# Altium project USB_TO_IO_DEVICE_V102.PrjPCB
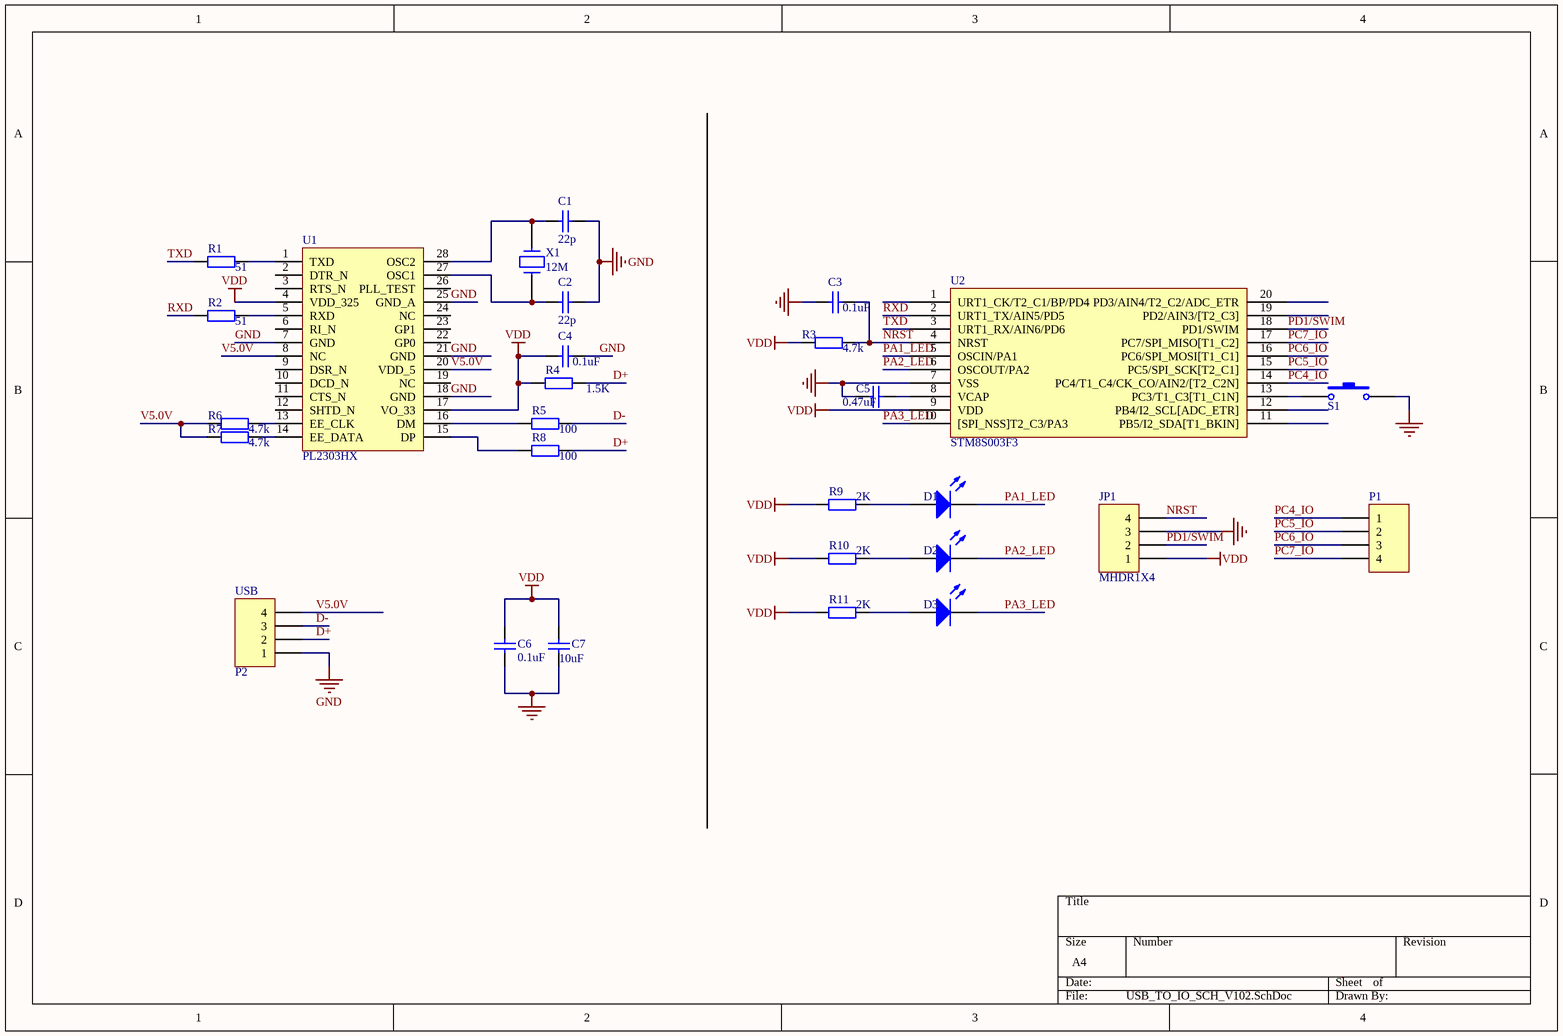
[diagram p0: USB_TO_IO_SCH_V102.SchDoc]
1 sheet, 28 parts. Net scope: global (net labels, ports and power ports of the same name join across sheets).
Board file: USB_TO_IO_PCB_V102.PcbDoc

## Sheet USB_TO_IO_SCH_V102.SchDoc
size A4

### Parts
C1  value 22p  [CS0603]  (hidden comment: Cap_0603)
C2  value 22p  [CS0603]  (hidden comment: Cap_0603)
C3  value 0.1uF  [CS0603]  (hidden comment: Cap_0603)
C4  value 0.1uF  [CS0603]  (hidden comment: Cap_0603)
C5  value 0.47uF  [CS0603]  (hidden comment: Cap_0603)
C6  value 0.1uF  [CS0603]  (hidden comment: Cap_0603)
C7  value 10uF  [CAP_8050]  (hidden comment: Cap_0603)
D1  LED  [LED_0603]  (value not drawn)
D2  LED  [LED_0603]  (value not drawn)
D3  LED  [LED_0603]  (value not drawn)
JP1  MHDR1X4  [MHDR1X4]
P1  Header 4  [HDR1X4]  (value not drawn)
P2  USB  [USB_M]
R1  value 51  [S0603]  (hidden comment: Reg_0603)
R2  value 51  [S0603]  (hidden comment: Reg_0603)
R3  value 4.7k  [S0603]  (hidden comment: Reg_0603)
R4  value 1.5K  [S0603]  (hidden comment: Reg_0603)
R5  value 100  [S0603]  (hidden comment: Reg_0603)
R6  value 4.7k  [S0603]  (hidden comment: Reg_0603)
R7  value 4.7k  [S0603]  (hidden comment: Reg_0603)
R8  value 100  [S0603]  (hidden comment: Reg_0603)
R9  value 2K  [S0603]  (hidden comment: Reg_0603)
R10  value 2K  [S0603]  (hidden comment: Reg_0603)
R11  value 2K  [S0603]  (hidden comment: Reg_0603)
S1  SW  [SWITCH-2]  (value not drawn)
U1  PL2303HX  [SSOP28]
U2  STM8S003F3  [STM8S003F3]
X1  value 12M  [XATL]  (hidden comment: CRYSTAL)

### Nets
GND: C1.2 C2.2 C3.1 C4.2 C5.1 C6.1 C7.1 JP1.3 P2.1 S1.2 U1.7(GND) U1.18(GND) U1.21(GND) U1.25(GND_A) U2.7(VSS)
VDD: C4.1 C6.2 C7.2 JP1.1 R3.1 R4.1 R9.1 R10.1 R11.1 U1.4(VDD_325) U1.17(VO_33) U2.9(VDD)
D+: P2.2 R4.2 R8.2
D-: P2.3 R5.2
NRST: C3.2 JP1.4 R3.2 U2.4(NRST)
PA1_LED: D1.2(K) U2.5(OSCIN/PA1)
PA2_LED: D2.2(K) U2.6(OSCOUT/PA2)
PA3_LED: D3.2(K) U2.10([SPI_NSS]T2_C3/PA3)
PC4_IO: P1.1 U2.14(PC4/T1_C4/CK_CO/AIN2/[T2_C2N])
PC5_IO: P1.2 U2.15(PC5/SPI_SCK[T2_C1])
PC6_IO: P1.3 U2.16(PC6/SPI_MOSI[T1_C1])
PC7_IO: P1.4 U2.17(PC7/SPI_MISO[T1_C2])
PD1/SWIM: JP1.2 U2.18(PD1/SWIM)
RXD: R2.1 U2.2(URT1_TX/AIN5/PD5)
TXD: R1.1 U2.3(URT1_RX/AIN6/PD6)
V5.0V: P2.4 R6.1 R7.1 U1.8(NC) U1.20(VDD_5)
NetC1_1: C1.1 U1.28(OSC2) X1.2
NetC2_1: C2.1 U1.27(OSC1) X1.1
NetC5_2: C5.2 U2.8(VCAP)
NetD1_1: D1.1(A) R9.2
NetD2_1: D2.1(A) R10.2
NetD3_1: D3.1(A) R11.2
NetR1_2: R1.2 U1.1(TXD)
NetR2_2: R2.2 U1.5(RXD)
NetR5_1: R5.1 U1.16(DM)
NetR6_2: R6.2 U1.13(EE_CLK)
NetR7_2: R7.2 U1.14(EE_DATA)
NetR8_1: R8.1 U1.15(DP)
NetS1_1: S1.1 U2.13(PC3/T1_C3[T1_C1N])

Not connected (* = marked no-connect by the designer): U1 2(DTR_N) 3(RTS_N) 6(RI_N) 9(DSR_N) 10(DCD_N) 11(CTS_N) 12(SHTD_N) 19(NC) 22(GP0) 23(GP1) 24(NC) 26(PLL_TEST); U2 1(URT1_CK/T2_C1/BP/PD4) 11(PB5/I2_SDA[T1_BKIN]) 12(PB4/I2_SCL[ADC_ETR]) 19(PD2/AIN3/[T2_C3]) 20(PD3/AIN4/T2_C2/ADC_ETR)

### Library data of the parts
C1-C7 = cap
D1-D3 = LED0
JP1 = MHDR1X4: Header, 4-Pin; LatestRevisionDate: 17-Jul-2002; LatestRevisionNote: Re-released for DXP Platform.; Publisher: Altium Limited
P2 = Header 4
R1-R11 = Register